# EAGLE design 5led (EAGLE 5.10)
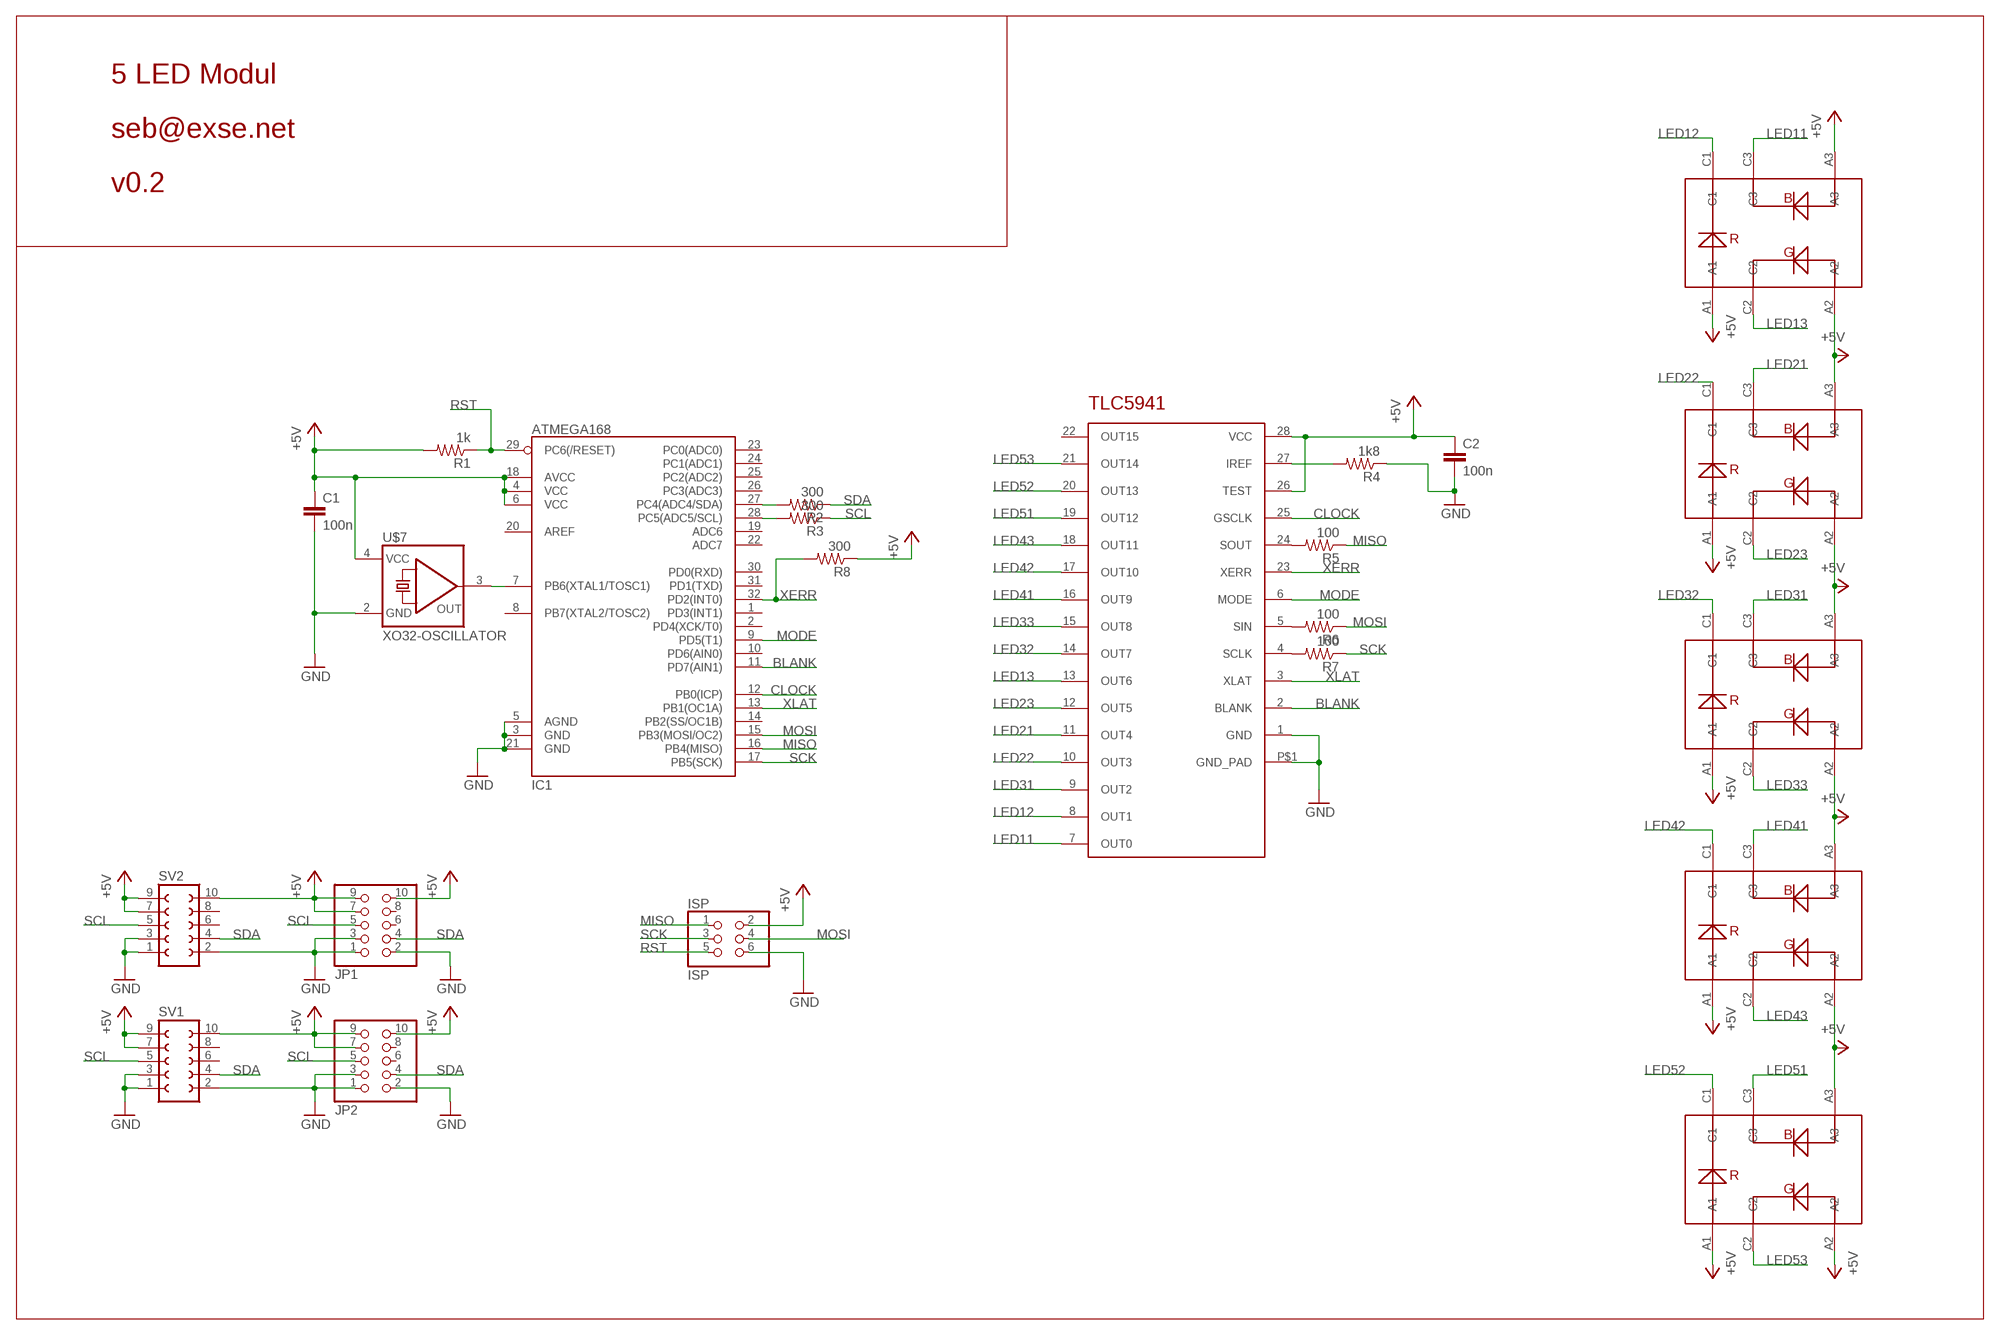
[diagram p0: schematic, sheet 1]

## Parts
C1  100n  CAP0805  [0805]
C2  100n  CAP0805  [0805]
IC1  ATMEGA168  [TQFP32-08]
IC2  TLC5941  [SSOP28]
ISP  ISP  PINHD-2X03_2.54  [2X03]
JP1  PINHD-2X05_2.54-90°  [2X05/90]
JP2  PINHD-2X05_2.54-SMD-90°  [2X05SMD/90]
R1  1k  RESISTOR  [0805]
R2  300  RESISTOR  [0805]
R3  300  RESISTOR  [0805]
R4  1k8  RESISTOR  [0805]
R5  100  RESISTOR  [0805]
R6  100  RESISTOR  [0805]
R7  100  RESISTOR  [0805]
R8  300  RESISTOR  [0805]
SV1  FE05-2W  [FE05-2W]
SV2  FE05-2W  [FE05-2W]
U$2  OSRAM_LRTB_G6TG  [PLCC-6]
U$3  OSRAM_LRTB_G6TG  [PLCC-6]
U$4  OSRAM_LRTB_G6TG  [PLCC-6]
U$5  OSRAM_LRTB_G6TG  [PLCC-6]
U$6  OSRAM_LRTB_G6TG  [PLCC-6]
U$7  XO32-OSCILLATOR  [XO32]

## Nets
+5V: C1.1 C2.1 IC1.4(VCC) IC1.6(VCC) IC1.18(AVCC) IC2.26(TEST) IC2.28(VCC) ISP.2 JP1.7 JP1.9 JP1.10 JP2.7 JP2.9 JP2.10 R1.2 R8.1 SV1.7 SV1.9 SV1.10 SV2.7 SV2.9 SV2.10 U$2.A1 U$2.A2 U$2.A3 U$3.A1 U$3.A2 U$3.A3 U$4.A1 U$4.A2 U$4.A3 U$5.A1 U$5.A2 U$5.A3 U$6.A1 U$6.A2 U$6.A3 U$7.4(VCC)
BLANK: IC1.11(PD7(AIN1)) IC2.2(BLANK)
CLOCK: IC1.12(PB0(ICP)) IC2.25(GSCLK)
GND: C1.2 C2.2 IC1.3(GND) IC1.5(AGND) IC1.21(GND) IC2.1(GND) IC2.P$1(GND_PAD) ISP.6 JP1.1 JP1.2 JP1.3 JP2.1 JP2.2 JP2.3 R4.1 SV1.1 SV1.2 SV1.3 SV2.1 SV2.2 SV2.3 U$7.2(GND)
LED11: IC2.7(OUT0) U$2.C3
LED12: IC2.8(OUT1) U$2.C1
LED13: IC2.13(OUT6) U$2.C2
LED21: IC2.11(OUT4) U$3.C3
LED22: IC2.10(OUT3) U$3.C1
LED23: IC2.12(OUT5) U$3.C2
LED31: IC2.9(OUT2) U$4.C3
LED32: IC2.14(OUT7) U$4.C1
LED33: IC2.15(OUT8) U$4.C2
LED41: IC2.16(OUT9) U$5.C3
LED42: IC2.17(OUT10) U$5.C1
LED43: IC2.18(OUT11) U$5.C2
LED51: IC2.19(OUT12) U$6.C3
LED52: IC2.20(OUT13) U$6.C1
LED53: IC2.21(OUT14) U$6.C2
MISO: IC1.16(PB4(MISO)) ISP.1 R5.1
MODE: IC1.9(PD5(T1)) IC2.6(MODE)
MOSI: IC1.15(PB3(MOSI/OC2)) ISP.4 R6.1
N$1: IC2.24(SOUT) R5.2
N$2: IC1.27(PC4(ADC4/SDA)) R2.2
N$3: IC1.28(PC5(ADC5/SCL)) R3.2
N$4: IC2.5(SIN) R6.2
N$5: IC2.4(SCLK) R7.2
N$6: IC1.7(PB6(XTAL1/TOSC1)) U$7.3(OUT)
N$13: IC2.27(IREF) R4.2
RST: IC1.29(PC6(/RESET)) ISP.5 R1.1
SCK: IC1.17(PB5(SCK)) ISP.3 R7.1
SCL: JP1.5 JP2.5 R3.1 SV1.5 SV2.5
SDA: JP1.4 JP2.4 R2.1 SV1.4 SV2.4
XERR: IC1.32(PD2(INT0)) IC2.23(XERR) R8.2
XLAT: IC1.13(PB1(OC1A)) IC2.3(XLAT)
Unconnected: IC1.1(PD3(INT1)) IC1.2(PD4(XCK/T0)) IC1.8(PB7(XTAL2/TOSC2)) IC1.10(PD6(AIN0)) IC1.14(PB2(SS/OC1B)) IC1.19(ADC6) IC1.20(AREF) IC1.22(ADC7) IC1.23(PC0(ADC0)) IC1.24(PC1(ADC1)) IC1.25(PC2(ADC2)) IC1.26(PC3(ADC3)) IC1.30(PD0(RXD)) IC1.31(PD1(TXD)) IC2.22(OUT15) JP1.6 JP1.8 JP2.6 JP2.8 SV1.6 SV1.8 SV2.6 SV2.8

## Notes on the sheet
- 5 LED Modul
- seb@exse.net
- v0.2

## Library data of the parts
C1 C2 = SparkFun:CAP: Capacitor Standard 0603 ceramic capacitor, and 0.1" leaded capacitor.
IC1 = SparkFun:ATMEGA168
IC2 = tlc:TLC5941
ISP = pinhead-2:PINHD-2X03: PIN HEADER
JP1 JP2 = pinhead-2:PINHD-2X05: PIN HEADER
R1-R8 = SparkFun:RESISTOR: Resistor Basic schematic elements and footprints for 0603, 1206, and PTH 1/10th watt (small) resistors.
SV1 SV2 = con-lsta:FE05-2W: FEMALE HEADER
U$2-U$6 = seb:OSRAM_LRTB_G6TG
U$7 = seb:XO32-OSCILLATOR

## Board
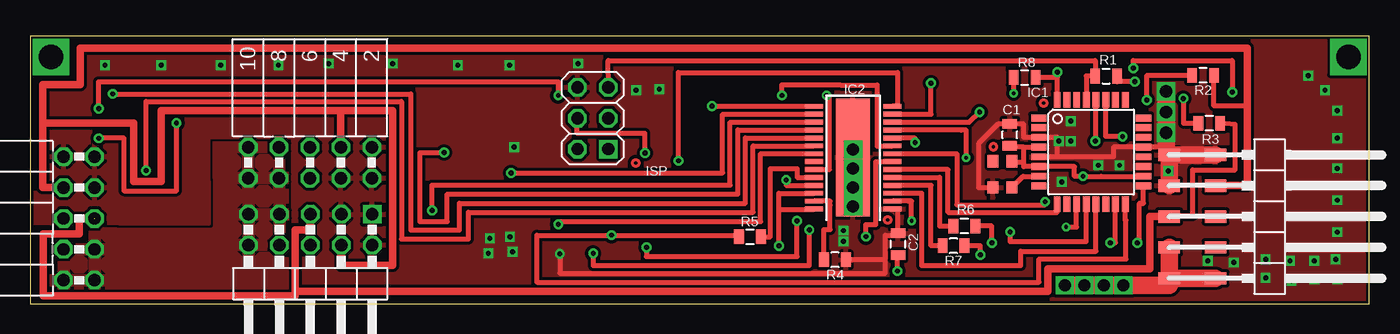
[diagram p1: board, top side]
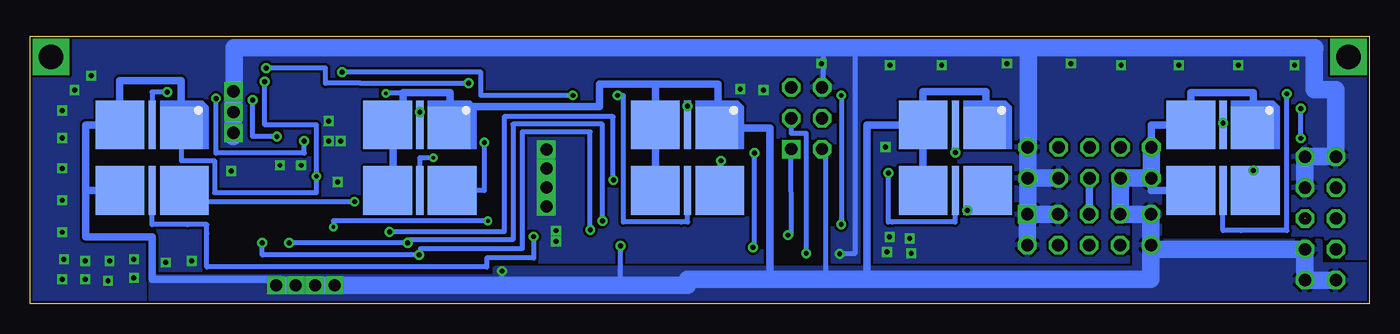
[diagram p2: board, bottom side, seen from below]

Size 110 x 22 mm. Coordinates in mm from the lower left corner, seen from the top.
Outline: 0,0 110,0 110,22 0,22 0,0
Copper layers (1*16): Top 0.035mm / dielectric 1.5mm / Bottom 0.035mm
Design rules "default *": minimum track width 10mil, minimum drill 24mil, track to track 8mil, track to pad 8mil, pad to pad 8mil, via to via 8mil, smd to smd 8mil, copper to edge 8mil, drill to drill 8mil, minimum pad ring 10mil, minimum via ring 8mil, stop-mask expansion 4mil, vias tented up to drill 100mil, thermal gap 10mil
bRestrict: 2 lines

### Footprints (pad centres in the part's own frame; a part is rotated, then mirrored left to right if it is on the bottom)
0805 = smd 0.8 x 1.2: 1 -0.9,0; 2 0.9,0
TQFP32-08 = smd 1.27 x 0.559: 1 -4.293,2.8; 2 -4.293,2; 3 -4.293,1.2; 4 -4.293,0.4; 5 -4.293,-0.4; 6 -4.293,-1.2; 7 -4.293,-2; 8 -4.293,-2.8; 17 4.293,-2.8; 18 4.293,-2; 19 4.293,-1.2; 20 4.293,-0.4; 21 4.293,0.4; 22 4.293,1.2; 23 4.293,2; 24 4.293,2.8 | smd 0.559 x 1.27: 9 -2.8,-4.293; 10 -2,-4.293; 11 -1.2,-4.293; 12 -0.4,-4.293; 13 0.4,-4.293; 14 1.2,-4.293; 15 2,-4.293; 16 2.8,-4.293; 25 2.8,4.293; 26 2,4.293; 27 1.2,4.293; 28 0.4,4.293; 29 -0.4,4.293; 30 -1.2,4.293; 31 -2,4.293; 32 -2.8,4.293
SSOP28 = smd 0.4 x 1.5: 1 -4.225,-3.225; 2 -3.575,-3.225; 3 -2.925,-3.225; 4 -2.275,-3.225; 5 -1.625,-3.225; 6 -0.975,-3.225; 7 -0.325,-3.225; 8 0.325,-3.225; 9 0.975,-3.225; 10 1.625,-3.225; 11 2.275,-3.225; 12 2.925,-3.225; 13 3.575,-3.225; 14 4.225,-3.225; 15 4.225,3.225; 16 3.575,3.225; 17 2.925,3.225; 18 2.275,3.225; 19 1.625,3.225; 20 0.975,3.225; 21 0.325,3.225; 22 -0.325,3.225; 23 -0.975,3.225; 24 -1.625,3.225; 25 -2.275,3.225; 26 -2.925,3.225; 27 -3.575,3.225; 28 -4.225,3.225 | smd 9.7 x 2.8: P$1 0,0
2X03 = drill 1.016 square: 1 -2.54,-1.27 | drill 1.016 octagon: 2 -2.54,1.27; 3 0,-1.27; 4 0,1.27; 5 2.54,-1.27; 6 2.54,1.27
2X05/90 = drill 1.016 square: 1 -5.08,-6.35 | drill 1.016 octagon: 2 -5.08,-3.81; 3 -2.54,-6.35; 4 -2.54,-3.81; 5 0,-6.35; 6 0,-3.81; 7 2.54,-6.35; 8 2.54,-3.81; 9 5.08,-6.35; 10 5.08,-3.81
2X05SMD/90 = smd 1.016 x 1.778: 1 -1.27,-8.89; 2 -1.27,-5.08; 3 1.27,-8.89; 4 1.27,-5.08; 5 3.81,-8.89; 6 3.81,-5.08; 7 6.35,-8.89; 8 6.35,-5.08; 9 8.89,-8.89; 10 8.89,-5.08
FE05-2W = drill 1.016 octagon: 1 -5.08,1.27; 2 -5.08,-1.27; 3 -2.54,1.27; 4 -2.54,-1.27; 5 0,1.27; 6 0,-1.27; 7 2.54,1.27; 8 2.54,-1.27; 9 5.08,1.27; 10 5.08,-1.27
PLCC-6 = smd 3.5 x 3.5: A1 2.4,2.45 | smd 4 x 4: A2 -2.65,2.7; A3 -2.65,-2.7; C1 2.65,-2.7 | smd 0.6 x 4: C2 0,2.7; C3 0,-2.7
XO32 = smd 1 x 0.9: 1 1.075,0.775; 2 -1.075,0.775; 3 -1.075,-0.775; 4 1.075,-0.775

### Placement (x,y rotation side)
C1  80.47,13.89 90 top
C2  71.29,4.89 90 top
IC1  87.16,12.47 0 top
IC2  67.6,12 90 top
ISP  46.23,15.25 90 top
JP1  23,1 180 top
JP2  102.46,10.97 270 top
R1  88.39,18.71 0 top
R2  96.36,18.78 180 top
R3  96.86,14.84 180 top
R4  66.11,3.6 180 top
R5  59.12,5.5 0 top
R6  76.75,6.38 180 top
R7  75.85,4.75 180 top
R8  81.7,18.6 0 top
SV1  22.97,11.59 180 top
SV2  4,7 270 top
U$2  100,12 0 bottom
U$3  78,12 0 bottom
U$4  56,12 0 bottom
U$5  34,12 0 bottom
U$6  12,12 0 bottom
U$7  79.88,10.62 90 top

### Tracks (layer width: path | path; a pad name or v marks a point on that pad's centre or on a via)
+5V  (via drill 0.3, 0.4, 1)
  Top 0.406: v61.5,4.75 61.5,7.76 | 81.62,11.6 81.62,11.27 IC1.6 85.8,11.27 85.8,10.47 v86.5,10.47 | 81.62,11.6 81.62,12.87 | v86.5,10.47 88,10.47 | C2.1 71.25,3.87 v71.25,2.67 | 81.62,12.87 80.47,12.87 C1.1 80.8,12.99 | v90.75,18.25 89.29,18.25 R1.2 | 81.62,12.87 IC1.4 | v86.5,10.47 IC1.18 | 61.5,7.76 61.5,9.07 IC2.26 | IC2.28 64.38,7.76 61.5,7.76 | U$7.4 80.75,11.6 81.62,11.6 | v80.8,17.3 R8.1
  Top 1.422: JP2.9 JP2.10 | JP2.9 JP2.7 | JP2.9 93.57,2 | v85,1.5 v86.6,1.5 v88.2,1.5 v89.8,1.5 93.57,1.5 JP2.9
  Bottom 0.406: 61.5,1.5 v61.5,4.75 | 71.25,1.5 v71.25,2.67 | v90.75,18.25 90.75,14.7 86.5,14.7 v86.5,10.47 86.5,9.12 94.88,9.12 94.88,11.75 97.6,11.75 U$2.A1 | ISP.2 44.62,12.71 44.62,2 | 79.38,17.3 v80.8,17.3
  Bottom 0.61: U$6.A1 9.5,14.45 9.5,17.35 14.65,17.35 U$6.A2 17.89,14.7 SV1.10 | U$5.A1 31.5,14.45 31.5,17.45 36.65,17.45 U$5.A2 | 58.65,18.05 53.5,18.05 53.5,14.45 U$4.A1 49.25,14.45 49.25,2 | 58.65,18.05 U$4.A2 U$4.A3 | U$3.A1 75.5,14.45 75.5,16.2 | 75.5,16.2 75.5,17.35 79.38,17.35 79.38,17.3 79.38,15.25 80.65,15.25 U$3.A2 80.65,14.27 80.19,13.81 80.19,12 80.19,9.3 U$3.A3 | U$2.A1 97.6,18.35 102.65,18.35 U$2.A2 105.45,14.7 105.45,9.1 | 105.45,9.1 105.45,5.5 100,5.5 100,2 89.5,2 v89.8,1.5 | U$5.A2 41.25,14.7 41.25,2 | 58.65,18.05 63.25,18.05 63.25,16.2 75.5,16.2 | U$6.A3 17.89,9.3 SV1.9 | U$5.A2 U$5.A3 | U$2.A3 105.45,9.3 105.45,9.1
  Bottom 1.422: SV2.10 SV2.9 SV2.7 12,4.46 17.92,4.46 JP1.10 | JP1.10 JP1.9 JP1.7 20.43,7.35 SV1.7 SV1.9 SV1.10 | v89.8,1.5 71.25,1.5 61.5,1.5 56,1.5 56,2 49.25,2 44.62,2 41.25,2 34,2 17.92,2 JP1.10
  pour Top (rank 2): -0.12,6.62 15.31,6.62 15.31,13.62 21.69,13.62 21.69,0 -0.12,0
  pour Bottom: 0.2,3.2 4,3.2 4,5.1 17.2,5.1 17.2,10.3 19.3,10.3 19.3,2.9 71.8,2.9 71.8,2.2 100.1,2.2 100.1,0.2 0.2,0.2
BLANK  (via drill 0.3)
  Top 0.406: 72.4,8.43 72.12,8.43 | 72.4,8.43 72.12,8.43 | 72.12,8.43 IC2.2 | 72.4,8.43 72.12,8.43 | v72.4,6.8 72.4,8.43 | v85.1,6.3 85.96,6.3 IC1.11
  Bottom 0.406: v72.4,6.8 85.1,6.8 v85.1,6.3
CLOCK  (via drill 0.4)
  Top 0.406: IC1.12 86.76,5.1 80.5,5.1 v80.5,5.9 | IC2.25 62.1,9.72 v62.1,10.18
  Bottom 0.406: v80.5,5.9 71.08,5.9 71.08,15.38 62.12,15.38 62.12,10.18 v62.1,10.18
GND  (via drill 0.4, 1)
  Top 0.406: 93.32,12.87 IC1.21 89,12.87 89,12.07 84.38,12.07 | C2.2 71.19,5.79 | 80.47,14.75 C1.2 80.43,14.75 79.5,14.75 77.9,13.15 77.9,12.9 77.9,9.55 U$7.2 | 70.25,3.6 R4.1 67.57,3.6 | C2.2 71.29,5.62 70.25,5.62 70.25,3.6 | v43.5,4.1 43.5,2.5 70.25,2.5 70.25,3.6 | 80.47,14.75 81.62,14.75 81.62,13.67 IC1.3 84.38,13.67 84.38,12.07 | 80.47,14.75 80.38,14.75 | 84.38,12.07 IC1.5 | C2.2 71.3,7.78 IC2.1
  Top 1.422: JP2.1 JP2.3 | JP2.1 93.32,12.87 v93.32,17.45 | JP2.1 JP2.2
  Bottom 0.406: ISP.6 44.88,17.79 44.88,21.05 | v43.5,4.1 42.25,4.1 42.25,21.05
  Bottom 1.422: SV2.3 SV2.1 SV2.2 2.73,17.6 4.5,17.6 4.5,20.65 4.47,21.05 28,21.05 | 28.05,7.35 JP1.3 | SV1.1 SV1.3 | 28,21.05 42.25,21.05 44.88,21.05 68.62,21.05 93.25,21.05 93.25,16.75 v93.32,17.45 v93.32,15.75 v93.32,14.05 93.32,13.74 | SV1.1 28.05,7.35 | SV1.1 SV1.2 28,12.86 28,21.05 | 28.05,7.35 JP1.1 JP1.2
  other vias: 67.6,12.68 67.6,11.1 67.6,9.55 67.6,8 49.77,17.55 51.67,17.65 45,19.75 39.38,19.62 35.12,19.62 29.75,19.75 24.5,19.75 20.38,19.62 15.62,19.62 10.75,19.62 6.12,19.62 37.62,4.12 39.62,4.25 37.75,5.35 39.4,5.47 39.75,12.88 66.8,6 66.8,5.12 101.5,3.62 101.5,2.12 103.5,3.5 103.62,1.88 105.5,3.5 105.5,2 107.25,3.62 107.38,2 107.38,5.88 107.38,8.5 107.38,11.12 107.38,13.62 107.38,15.88 106.38,17.55 105,18.75 98.88,3.38 96.75,3.5 93.5,10.9 85.5,15 84.5,13.38 85.5,13.38 87.75,11.38 89.5,11.38 84.75,10
  pour Bottom (rank 2): -0.12,22 110,22 110,0 -0.12,0
  pour Top (isolate 0.254): 0,22 110,22 110,0 21.69,0 21.62,13.69 14.56,13.69 14.62,6.56 0,6.62
GND__
  pour Bottom (rank 2): 71.97,18.5 71.88,20.12 48.5,20.23 48.33,19.5 48.52,18.68 49.75,18.68 49.75,18.5
LED11  (via drill 0.4)
  Top 0.406: v68.65,5.5 68.65,6.5 69.47,6.5 69.47,11.68 IC2.7
  Bottom 0.406: v68.65,5.5 68.65,3.75 72.5,3.75 72.5,3 95.5,3 95.5,5.75 95.5,6.5 97.1,6.5 100,6.5 U$2.C3
LED12  (via drill 0.4)
  Top 0.406: v83.38,8.38 83.38,8.12 76.12,8.12 76.12,12.32 IC2.8
  Bottom 0.406: U$2.C1 97.35,8.25 97.38,8.25 97.38,8.38 v83.38,8.38
LED13  (via drill 0.4)
  Top 0.406: v98.75,17.4 98.75,20 90.62,20 v90.62,19.38 | 74,15.57 v74,18.12 | 74,15.57 74,15.55 | IC2.13 74,15.57
  Bottom 0.406: U$2.C2 100,17.4 v98.75,17.4 | v90.62,19.38 85.75,19.38 85.75,18.12 82.88,18.12 82.88,18.1 74,18.1 v74,18.12
LED21  (via drill 0.3)
  Top 0.406: IC2.11 70.83,14.25 76.5,14.25 | 76.9,14.25 76.5,14.25 | v76.9,12 76.9,14.25 | 76.9,14.25 76.5,14.25
  Bottom 0.406: U$3.C3 78,12 v76.9,12
LED22  (via drill 0.4)
  Top 0.406: v72.7,13.25 72.7,13.61 70.83,13.61 IC2.10
  Bottom 0.406: U$3.C1 72.7,9.3 v72.7,13.25
LED23  (via drill 0.4)
  Top 0.406: IC2.12 77.12,14.93 78,15.8 v78,15.75
  Bottom 0.406: v78,15.75 U$3.C2
LED31  (via drill 0.4)
  Top 0.406: v61.75,17.12 61.75,18 66.55,18 66.55,17.98 69.58,17.98 69.58,12.97 | 69.58,12.97 IC2.9 | 69.58,12.97 69.58,12.96
  Bottom 0.406: v61.75,17.12 61.27,17.12 61.27,12.03 61.27,6.7 56.5,6.7 56,6.7 U$4.C3
LED32  (via drill 0.4)
  Top 0.406: v53.25,11.75 53.25,19 71.25,19 71.25,16.23 IC2.14
  Bottom 0.406: U$4.C1 53.35,11.75 v53.25,11.75
LED33  (via drill 0.4)
  Top 0.406: v56,16.25 56,16.2 56,16.23 IC2.15
  Bottom 0.406: U$4.C2 v56,16.25
LED41  (via drill 0.4)
  Top 0.406: v39.5,10.75 56.88,10.75 56.88,15.57 IC2.16
  Bottom 0.406: U$5.C3 34,6.7 39.2,6.7 39.5,6.7 v39.5,10.75
LED42  (via drill 0.4)
  Top 0.406: v33,7.65 33,9.75 57.5,9.75 57.5,14.93 IC2.17
  Bottom 0.406: v33,7.65 33,9.3 U$5.C1
LED43  (via drill 0.4)
  Top 0.406: v34,12.43 32,12.43 32,6.75 34.25,6.75 34.25,9 58.12,9 58.12,14.27 IC2.18
  Bottom 0.406: v34,12.43 U$5.C2
LED51  (via drill 0.4)
  Top 0.406: v6.75,17.25 31.25,17.25 31.25,6.05 35.25,6.05 35.25,8.25 58.75,8.25 58.75,13.62 IC2.19
  Bottom 0.406: v6.75,17.25 6.75,6 10.5,6 12,6 U$6.C3
LED52  (via drill 0.4)
  Top 0.406: v9.5,10.95 9.5,16.62 30.5,16.62 30.5,5.3 36,5.3 36,7.5 59.38,7.5 59.38,12.97 IC2.20
  Bottom 0.406: v9.5,10.95 9.35,10.85 U$6.C1
LED53  (via drill 0.4)
  Top 0.406: v43.38,6.5 43.38,6.75 60,6.75 60,12.32 IC2.21 | v43.38,17.12 43.38,18.25 5.6,18.25 v5.6,16.05 | v5.6,13.6 7.69,13.6 7.69,9.28 12,9.28 v12,14.85
  Bottom 0.406: v43.38,17.12 v43.38,6.5 | v5.6,13.6 v5.6,16.05 | v12,14.85 U$6.C2
MISO  (via drill 0.4)
  Top 0.406: R5.1 57.98,5.62 v47.75,5.62 41.62,5.62 41.62,1.75 82.88,1.75 82.88,3.67 90.03,3.67 90.03,6.88 89.96,6.88 IC1.16
  Bottom 0.406: ISP.1 47.48,5.62 v47.75,5.62
MODE
  Top 0.406: 84.36,7.5 75.4,7.5 75.4,11.03 IC2.6 | 84.36,7.5 84.38,7.5 | 84.36,7.5 IC1.9
MOSI  (via drill 0.4)
  Top 0.406: IC1.15 89.16,5 v88.75,5 | v63,6.8 63,3.88 50.62,3.88 v50.62,4.62 | v50.5,12.38 50.5,14 44.94,14 ISP.4 | v79,5 79,6.38 R6.1
  Bottom 0.406: v88.75,5 v79,5 79,5.25 70.35,5.25 70.35,14.75 63,14.75 v63,6.8 | v50.62,4.62 50.5,4.62 v50.5,12.38
N$1
  Top 0.406: R5.2 60.8,5.5 60.8,10.2 60.8,11.1 63,11.1 63,10.38 IC2.24
N$2  (via drill 0.4)
  Top 0.406: R2.2 91.75,18.78 v91.75,16.75 | v89.75,13.75 88.36,13.75 IC1.27
  Bottom 0.406: v91.75,16.75 91.75,13.75 v89.75,13.75
N$3  (via drill 0.4)
  Top 0.406: R3.2 94.75,14.84 v94.75,16.88 | v87.5,13.38 87.56,13.38 IC1.28
  Bottom 0.406: v94.75,16.88 94.75,12.38 87.5,12.38 v87.5,13.38
N$4
  Top 0.406: R6.2 74.7,6.38 74.7,10.38 IC2.5
N$5
  Top 0.406: R7.2 74,4.75 74,9.72 IC2.4
N$6
  Top 0.406: U$7.3 81.57,10.47 IC1.7
N$7  (via drill 2)
  other vias: 108.3,20.3
N$8  (via drill 2)
  other vias: 1.7,20.3
N$13
  Top 0.406: R4.2 65.2,6.1 65.7,6.1 65.7,8.1 65.7,8.43 IC2.27
RST
  Top 0.406: IC1.29 86.76,18.71 R1.1 87.49,20 47.48,20 ISP.5
SCK  (via drill 0.4)
  Top 0.406: v90.95,5 91.12,5 91.12,8.25 91.45,8.25 IC1.17 | v64,6.05 64,3.12 46.25,3.12 v46.25,4.12 | v78.05,4 78.05,4.75 R7.1
  Bottom 0.406: v90.95,5 90.95,4 77.97,4 | v64,6.05 64,14.12 69.6,14.12 69.6,4.5 77.97,4.5 77.97,4 | v46.25,4.12 46.25,14 47.48,14 ISP.3 | 77.97,4 v78.05,4
SCL  (1 unrouted)
  Top 0.406: R3.1 99,14.74 99,11 95.5,11 95.5,7.25 93.57,7.25 JP2.5
  Top 0.607: 5.25,7 4,7 4,5.73 1.06,5.73
  Top 0.61: JP1.5 23,6.06 21.75,6.06 21.75,1 | JP2.5 92,7.16 92,2.88 83.62,2.88 83.62,1 21.75,1 | 21.75,1 21.75,0.62 1.06,0.62 1.06,5.69 1.06,5.73
  Bottom 0.61: JP1.5 22.97,7.35 SV1.5
SDA
  Top 0.406: R2.1 97.25,18.28 97.25,16.25 100,16.25
  Top 0.61: SV2.4 1,9.54 1,14.85 | 25.51,15.88 SV1.4 | 25.51,15.88 29.75,15.88 29.75,3.12 25.54,3.12 JP1.4 | JP2.4 100,9.7 100,16.25 100,21 4.1,21 4.1,18 1,18 1,14.85 | 25.51,15.88 10.75,15.88 10.75,10.03 8.5,10.03 8.5,14.85 1,14.85
XERR  (via drill 0.4)
  Top 0.406: 65.65,11.03 65.65,17.12 v65.42,17.12 | IC1.32 84.36,19.12 v84.38,19.02 84.38,18.6 R8.2 | IC2.23 65.65,11.03 | 65.65,11.03 65.65,11.01
  Bottom 0.406: v65.42,17.12 72.97,17.12 72.97,19.02 v84.38,19.02
XLAT
  Top 0.406: IC1.13 87.56,4.3 81.38,4.3 81.38,3.12 73.25,3.12 73.25,9.07 IC2.3
(copper drawn outside any net)
  shapes: Top circle x4

### Text on the board
tStop: X5LED v0.2 | seb@exse.net
bRestrict: X5LED v0.2 | seb@exse.net